# EAGLE design Populated_PLG_sensor_Flash (EAGLE 7.7.0)
CNAME: SOOFA; CREVISION: 1.0; DESIGNER: COLIN M.
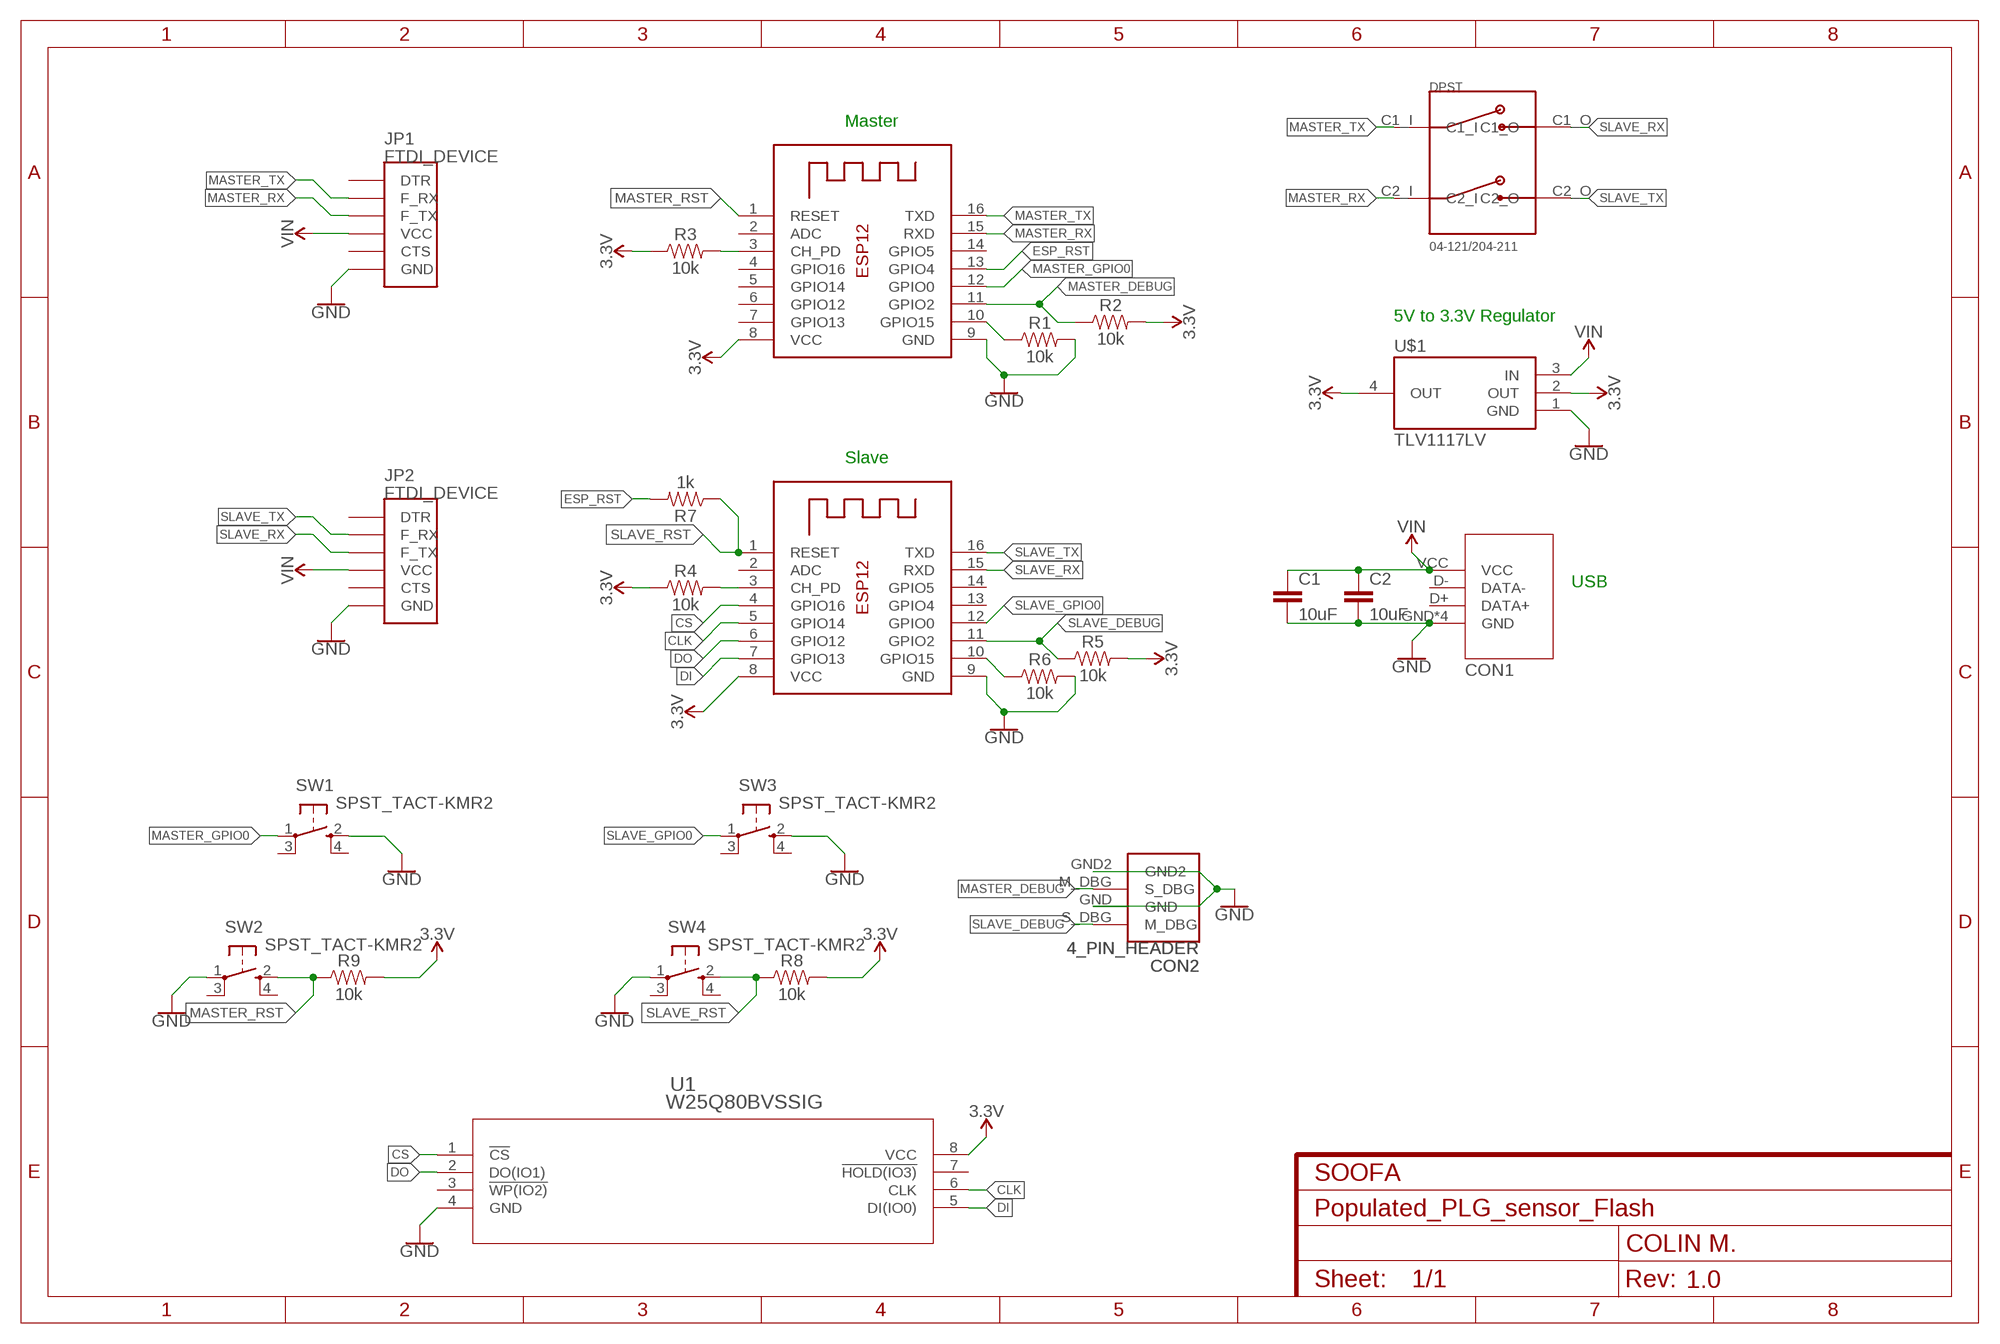
[diagram p0: schematic, sheet 1]

## Parts
C1  10uF  10UF-0603-6.3V-20%  [0603]
C2  10uF  10UF-0603-6.3V-20%  [0603]
CON1  USB_MOLEX_0480372200  [USB_MOLEX_0480372200]
CON2  4_PIN_HEADER  [22-23-2041]
DPST1  DPST_1POS  [DPST_1POS]
JP1  FTDI_DEVICE  [FTDI_DEVICE_SIDE]
JP2  FTDI_DEVICE  [FTDI_DEVICE_SIDE]
R1  10k  10KOHM-0603-1/10W-1%  [0603]
R2  10k  10KOHM-0603-1/10W-1%  [0603]
R3  10k  10KOHM-0603-1/10W-1%  [0603]
R4  10k  10KOHM-0603-1/10W-1%  [0603]
R5  10k  10KOHM-0603-1/10W-1%  [0603]
R6  10k  10KOHM-0603-1/10W-1%  [0603]
R7  1k  1KOHM-0603-1/10W-1%  [0603]
R8  10k  10KOHM-0603-1/10W-1%  [0603]
R9  10k  10KOHM-0603-1/10W-1%  [0603]
SW1  SPST_TACT-KMR2  [KMR2]
SW2  SPST_TACT-KMR2  [KMR2]
SW3  SPST_TACT-KMR2  [KMR2]
SW4  SPST_TACT-KMR2  [KMR2]
U1  W25Q80BVSSIG  [WIN_SS-8]
U$1  TLV1117LV  [SOT223]
X1  ESP-12  [ESP-12]
X2  ESP-12  [ESP-12]

## Nets
3.3V: R2.2 R3.1 R4.1 R5.2 R8.2 R9.2 U1.8(VCC) U$1.2(OUT) U$1.4(OUT) X1.8(VCC) X2.8(VCC)
CLK: U1.6(CLK) X2.5(GPIO14)
CS: U1.1(!CS) X2.4(GPIO16)
DI: U1.5(DI(IO0)) X2.7(GPIO13)
DO: U1.2(DO(IO1)) X2.6(GPIO12)
ESP_RST: R7.2 X1.13(GPIO4)
GND: C1.2 C2.2 CON1.GND CON1.GND2(GND) CON1.GND3(GND) CON1.GND4(GND) CON2.GND CON2.GND2 JP1.P$6(GND) JP2.P$6(GND) R1.2 R6.2 SW1.2(S) SW2.1(P) SW3.2(S) SW4.1(P) U1.4(GND) U$1.1(GND) X1.9(GND) X2.9(GND)
MASTER_DEBUG: CON2.M_DBG(S_DBG) R2.1 X1.11(GPIO2)
MASTER_GPIO0: SW1.1(P) X1.12(GPIO0)
MASTER_RST: R9.1 SW2.2(S) X1.1(RESET)
MASTER_RX: DPST1.C2_I JP1.P$3(F_TX) X1.15(RXD)
MASTER_TX: DPST1.C1_I JP1.P$2(F_RX) X1.16(TXD)
N$1: R3.2 X1.3(CH_PD)
N$2: R1.1 X1.10(GPIO15)
N$4: R4.2 X2.3(CH_PD)
N$8: R6.1 X2.10(GPIO15)
SLAVE_DEBUG: CON2.S_DBG(M_DBG) R5.1 X2.11(GPIO2)
SLAVE_GPIO0: SW3.1(P) X2.12(GPIO0)
SLAVE_RST: R7.1 R8.1 SW4.2(S) X2.1(RESET)
SLAVE_RX: DPST1.C1_O JP2.P$3(F_TX) X2.15(RXD)
SLAVE_TX: DPST1.C2_O JP2.P$2(F_RX) X2.16(TXD)
VIN: C1.1 C2.1 CON1.VCC JP1.P$4(VCC) JP2.P$4(VCC) U$1.3(IN)
Unconnected: CON1.D+(DATA+) CON1.D-(DATA-) JP1.P$1(DTR) JP1.P$5(CTS) JP2.P$1(DTR) JP2.P$5(CTS) SW1.3(P1) SW1.4(S1) SW2.3(P1) SW2.4(S1) SW3.3(P1) SW3.4(S1) SW4.3(P1) SW4.4(S1) U1.3(!WP(IO2)) U1.7(!HOLD(IO3)) X1.2(ADC) X1.4(GPIO16) X1.5(GPIO14) X1.6(GPIO12) X1.7(GPIO13) X1.14(GPIO5) X2.2(ADC) X2.13(GPIO4) X2.14(GPIO5)

## Notes on the sheet
- Master
- 5V to 3.3V Regulator
- Slave
- USB

## Library data of the parts
C1 C2 = SparkFun-Capacitors:10UF: 10.0µF ceramic capacitors A capacitor is a passive two-terminal electrical component used to store electrical energy temporarily in an electric field.; PROD_ID: CAP-11015
CON1 = Other:USB_MOLEX_0480372200
CON2 = Other:4_PIN_HEADER
DPST1 = Other:DPST_1POS
JP1 JP2 = 0_soofa_library:FTDI_DEVICE: Connector which mates to FTDI basic or FTDI cable.
R1-R6 R8 R9 = SparkFun-Resistors:10KOHM: 10kΩ resistor A resistor is a passive two-terminal electrical component that implements electrical resistance as a circuit element. Resistors act to reduce current flow, and, at the same time, act to lower voltage levels within circuits. - Wikipedia; PROD_ID: RES-00824
R7 = SparkFun-Resistors:1KOHM: 1kΩ resistor A resistor is a passive two-terminal electrical component that implements electrical resistance as a circuit element. Resistors act to reduce current flow, and, at the same time, act to lower voltage levels within circuits. - Wikipedia; PROD_ID: RES-07856
SW1-SW4 = adafruit:SPST_TACT: SMT 6mm switch, EVQQ2 series http://www.ladyada.net/library/eagle
U1 = SPI_Flash:W25Q80BVSSIG; MANUFACTURER_PART_NUMBER: W25Q80BVSSIG; VENDOR: WINBOND
U$1 = soofa_library:TLV1117LV
X1 X2 = adafruit:ESP-12

## Board
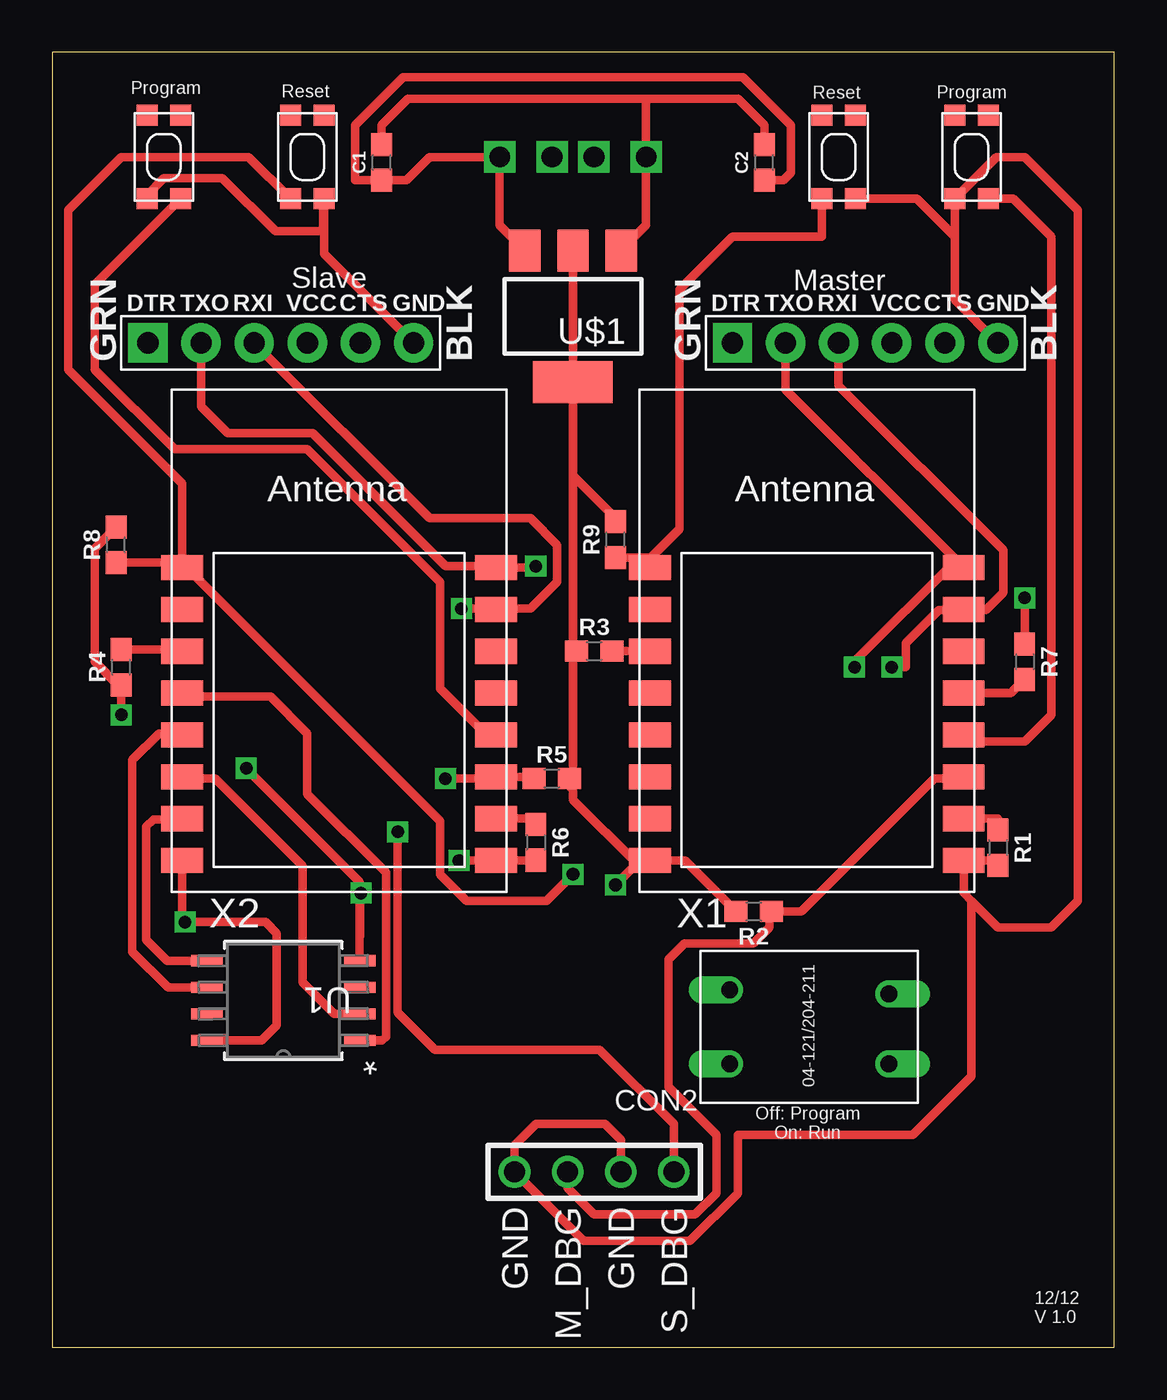
[diagram p1: board, top side]
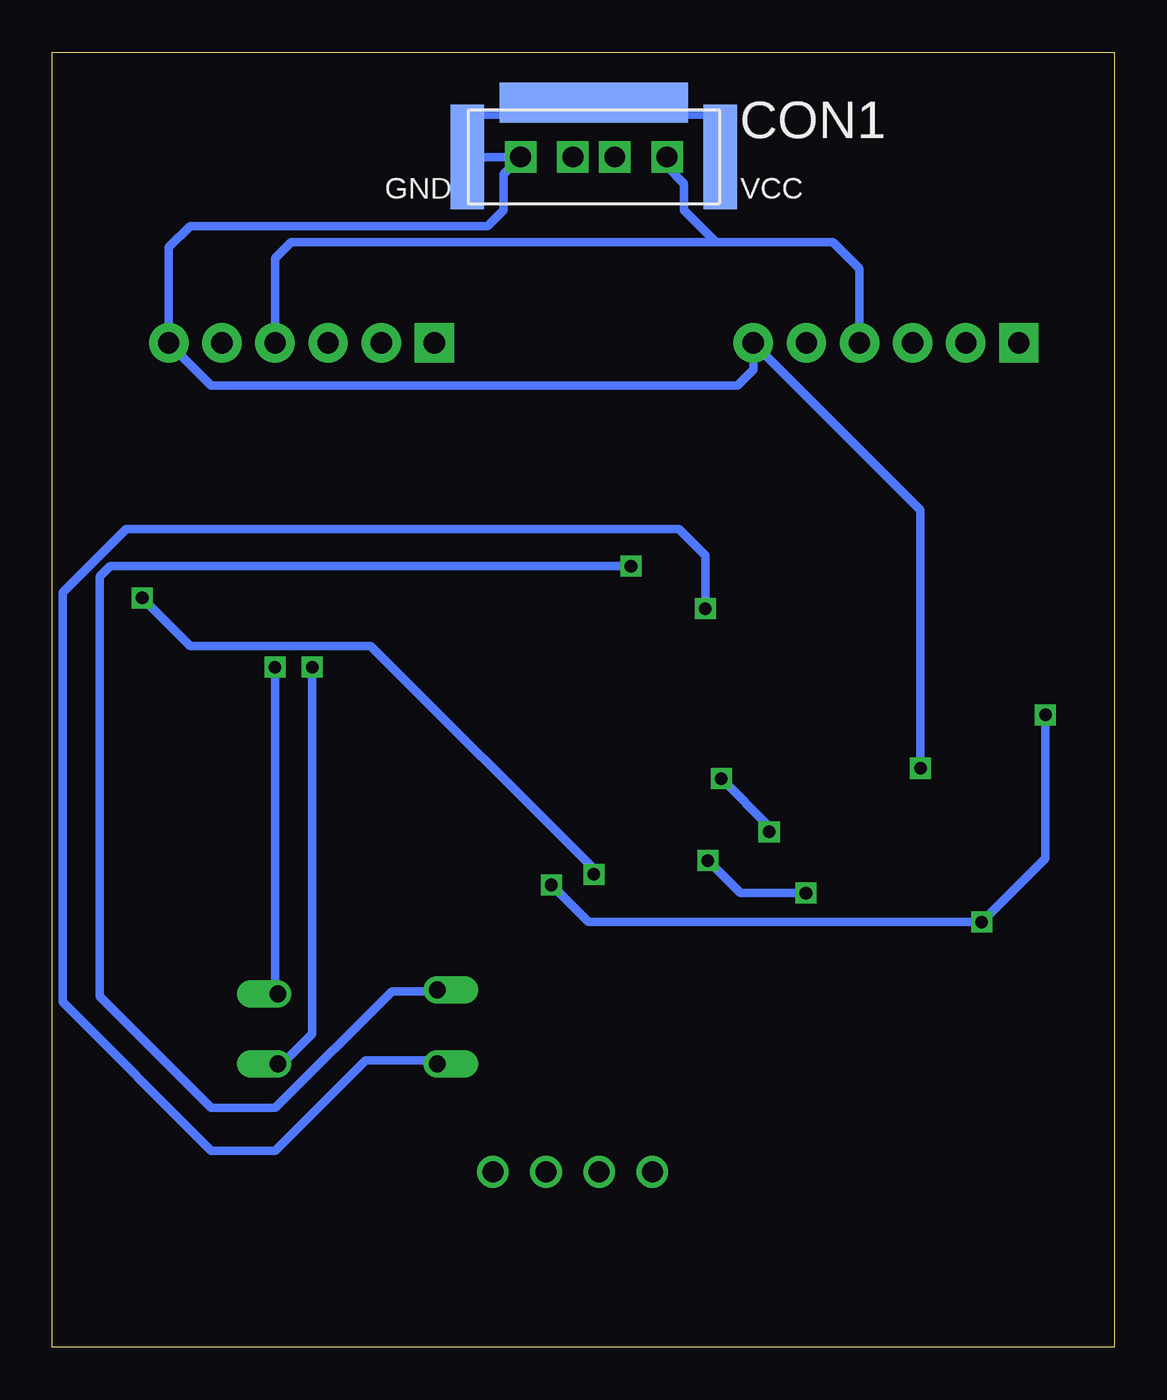
[diagram p2: board, bottom side, seen from below]

Size 50.78 x 61.9 mm. Coordinates in mm from the lower left corner, seen from the top.
Outline: 0,0 50.78,0 50.78,61.9 0,61.9 0,0
Copper layers (1*16): Top 0.035mm / dielectric 1.5mm / Bottom 0.035mm
Design rules "default": minimum track width 10mil, minimum drill 24mil, track to track 8mil, track to pad 8mil, pad to pad 8mil, via to via 8mil, smd to smd 8mil, copper to edge 40mil, drill to drill 8mil, minimum pad ring 10mil, minimum via ring 8mil, stop-mask expansion 4mil, vias tented up to drill 0mil, thermal gap 10mil

### Footprints (pad centres in the part's own frame; a part is rotated, then mirrored left to right if it is on the bottom)
0603 = smd 1.1 x 1: 1 -0.85,0; 2 0.85,0
USB_MOLEX_0480372200 = drill 1 square: D+ -1,0; D- 1,0; GND -3.5,0; VCC 3.5,0 | smd 1.6 x 5: GND2 -6.05,0; GND4 6.05,0 | smd 9 x 1.9: GND3 0,2.6
22-23-2041 = drill 1: GND -1.27,0; GND2 3.81,0; M_DBG 1.27,0; S_DBG -3.81,0
DPST_1POS = drill 0.8 offset: C1_I 1.86,-9.01; C1_O 1.86,-1.39; C2_I 5.2,-9.01; C2_O 5.4,-1.39
FTDI_DEVICE_SIDE = drill 1.016 pad 1.88 square: P$1 -6.35,0 | drill 1.016 pad 1.88: P$2 -3.81,0; P$3 -1.27,0; P$4 1.27,0; P$5 3.81,0; P$6 6.35,0
KMR2 = smd 1 x 1: 1 2,0.8; 2 2,-0.8; 3 -2,0.8; 4 -2,-0.8
WIN_SS-8 = smd 1.499 x 0.533: 1 -3.658,1.905; 2 -3.658,0.635; 3 -3.658,-0.635; 4 -3.658,-1.905; 5 3.658,-1.905; 6 3.658,-0.635; 7 3.658,0.635; 8 3.658,1.905
SOT223 = smd 1.5 x 2: 1 -2.3,-3.15; 2 0,-3.15; 3 2.3,-3.15 | smd 3.8 x 2: 4 0,3.15
ESP-12 = smd 2 x 1.2: 1 -7.5,4.5; 2 -7.5,2.5; 3 -7.5,0.5; 4 -7.5,-1.5; 5 -7.5,-3.5; 6 -7.5,-5.5; 7 -7.5,-7.5; 8 -7.5,-9.5; 9 7.5,-9.5; 10 7.5,-7.5; 11 7.5,-5.5; 12 7.5,-3.5; 13 7.5,-1.5; 14 7.5,0.5; 15 7.5,2.5; 16 7.5,4.5

### Placement (x,y rotation side)
C1  15.75,56.64 90 top
C2  34.04,56.64 90 top
CON1  24.89,56.9 0 bottom
CON2  25.91,8.38 180 top
DPST1  30.99,11.68 90 top
JP1  38.86,48.01 0 top
JP2  10.92,48.01 0 top
R1  45.21,23.88 270 top
R2  33.53,20.83 180 top
R3  25.91,33.27 0 top
R4  3.3,32.51 90 top
R5  23.88,27.18 0 top
R6  23.11,24.13 270 top
R7  46.48,32.77 270 top
R8  3.05,38.35 90 top
R9  26.92,38.61 90 top
SW1  43.94,56.9 270 top
SW2  37.59,56.9 270 top
SW3  5.33,56.9 270 top
SW4  12.19,56.9 270 top
U1  11.04,16.57 180 top
U$1  24.89,49.28 180 top
X1  36.07,32.77 0 top
X2  13.72,32.77 0 top

### Tracks (layer width: path | path; a pad name or v marks a point on that pad's centre or on a via)
3.3V  (via drill 0.6)
  Top 0.406: U$1.2 U$1.4 24.89,41.66 | 24.89,41.66 24.89,33.27 | 24.89,33.27 24.89,27.18 | 24.89,27.18 24.89,26.67 | 24.89,26.67 24.89,26.16 27.94,23.11 | 27.94,23.11 28.42,23.11 X1.8 30.24,23.27 R2.2 | X2.8 6.22,20.45 v6.35,20.32 10.2,20.32 10.73,19.79 10.73,15.38 10.01,14.67 U1.8 | v26.92,22.1 27.94,23.11 | 24.73,26.84 24.89,26.67 | R3.1 24.89,33.27 | v3.3,30.23 R4.1 3.14,31.66 2.03,32.77 2.03,38.19 R8.2 | R9.2 26.92,39.62 24.89,41.66 | R5.2 24.89,27.18
  Bottom 0.406: v26.92,22.1 25.15,20.32 v6.35,20.32 3.3,23.37 v3.3,30.23
CLK
  Top 0.406: U1.6 5.53,17.21 3.83,18.91 3.83,28.06 5.1,29.33 6.15,29.33 X2.5
CS
  Top 0.406: U1.1 15.77,14.67 15.95,14.84 15.95,22.7 12.19,26.46 12.19,29.34 10.43,31.1 6.38,31.1 X2.4
DI
  Top 0.406: U1.5 5.49,18.48 4.49,19.48 4.49,24.89 4.84,25.24 6.19,25.24 X2.7
DO
  Top 0.406: U1.2 13.47,15.94 11.96,17.45 11.96,23.01 7.78,27.19 6.29,27.19 X2.6
ESP_RST
  Top 0.406: X1.13 45.83,31.27 R7.2
GND  (via drill 0.6)
  Top 0.406: U$1.1 28.39,53.63 CON1.GND 28.39,59.69 | 43.14,53.09 SW1.2 45.14,56.9 46.48,56.9 49.02,54.36 49.02,21.34 47.75,20.07 45.21,20.07 43.94,21.34 | 43.14,53.09 43.14,50.08 JP1.P$6 | SW2.1 41.33,54.9 43.14,53.09 | X2.9 23.1,23.27 R6.2 | SW3.2 4.53,55.08 5.33,55.88 8.13,55.88 10.67,53.34 12.95,53.34 12.95,54.9 SW4.1 12.99,52.29 JP2.P$6 | CON2.GND 27.18,9.91 26.42,10.67 23.11,10.67 22.1,9.65 CON2.GND2 25.4,5.08 30.48,5.08 32.77,7.37 32.77,10.16 41.15,10.16 43.94,12.95 43.94,21.34 | 43.94,21.34 43.57,21.71 X1.9 45.21,23.27 R1.2 | C1.2 15.75,58.42 17.02,59.69 28.39,59.69 | C2.2 34.04,58.42 32.77,59.69 28.39,59.69 | v14.75,21.71 14.71,21.67 14.71,19.64 14.7,19.63 U1.4 14.7,22.25 v9.28,27.68 | v19.45,23.27 X2.9 | X2.9
  Bottom 0.406: CON1.GND 29.21,56.08 29.21,54.36 29.97,53.59 44.2,53.59 45.21,52.58 JP1.P$6 43.18,45.97 18.03,45.97 17.27,46.74 JP2.P$6 9.28,40.01 v9.28,27.68 | CON1.GND CON1.GND2 | 28.39,59.24 28.19,59.44 24.95,59.44 | 24.95,59.44 CON1.GND3 24.89,58.93 30.99,58.93 | CON1.GND4 18.84,58.93 21.59,58.93 21.59,59.44 24.95,59.44 | CON1.GND 30.99,56.9 30.99,58.93 | 30.99,59.18 30.99,58.93 | v14.75,21.71 17.89,21.71 v19.45,23.27
MASTER_DEBUG
  Top 0.406: X1.11 43.48,27.18 42.16,27.18 35.81,20.83 R2.1 34.29,20.74 34.29,20.07 33.53,19.3 30.23,19.3 29.46,18.54 29.46,12.45 31.75,10.16 31.75,7.37 30.73,6.35 25.91,6.35 24.64,7.62 CON2.M_DBG
MASTER_GPIO0
  Top 0.406: SW1.1 45.94,54.9 47.75,53.09 47.75,30.23 46.48,28.96 43.88,28.96 X1.12
MASTER_RST
  Top 0.406: X1.1 28.08,37.76 R9.1 28.61,37.76 29.97,39.12 29.97,50.55 32.51,53.09 36.79,53.09 SW2.2
MASTER_RX  (via drill 0.6)
  Top 0.406: JP1.P$3 37.59,45.97 45.47,38.1 45.47,36.08 44.63,35.24 43.59,35.24 X1.15 43.54,35.23 42.38,35.23 40.81,33.67 40.81,32.51 v40.13,32.51
  Bottom 0.406: DPST1.C2_I 40.13,16.88 v40.13,32.51
MASTER_TX  (via drill 0.6)
  Top 0.406: JP1.P$2 35.05,45.78 43.21,37.62 | 43.21,37.62 X1.16 | v38.35,32.51 38.35,32.77 43.21,37.62
  Bottom 0.406: DPST1.C1_I 39.8,13.54 38.35,14.99 v38.35,32.51
N$1
  Top 0.406: R3.2 X1.3
N$2
  Top 0.406: X1.10 45.21,25.27 R1.1
N$4
  Top 0.406: R4.2 6.12,33.36 X2.3
N$8
  Top 0.406: X2.10 22.83,25.27 R6.1
SLAVE_DEBUG  (via drill 0.6)
  Top 0.406: CON2.S_DBG 29.72,10.67 26.16,14.22 18.29,14.22 16.51,16 v16.51,24.64 | v18.8,27.18 21.13,27.18 X2.11 22.94,27.27 R5.1
  Bottom 0.406: v16.51,24.64 16.51,24.89 v18.8,27.18
SLAVE_GPIO0
  Top 0.406: X2.12 21.08,29.13 21.08,28.96 18.54,31.5 18.54,36.58 12.19,42.93 5.84,42.93 2.03,46.74 2.03,50.79 SW3.1
SLAVE_RST  (via drill 0.6)
  Top 0.406: R8.1 5.98,37.5 X2.1 | X2.1 6.22,41.28 0.76,46.74 0.76,54.36 3.3,56.9 9.39,56.9 SW4.2 | X2.1 6.42,37.27 18.54,25.15 18.54,22.61 19.81,21.34 23.62,21.34 v24.89,22.61 | v46.48,35.81 R7.1
  Bottom 0.406: v24.89,22.61 24.89,22.86 35.56,33.53 44.2,33.53 v46.48,35.81
SLAVE_RX  (via drill 0.6)
  Top 0.406: 21.26,35.31 X2.15 | 21.26,35.31 22.86,35.31 24.13,36.58 24.13,38.35 22.86,39.62 18.03,39.62 JP2.P$3 | 21.26,35.31 v19.56,35.31
  Bottom 0.406: v19.56,35.31 19.56,37.85 20.83,39.12 47.24,39.12 50.29,36.07 50.29,16.51 43.18,9.4 40.13,9.4 35.81,13.72 32.55,13.72 DPST1.C1_O
SLAVE_TX  (via drill 0.6)
  Top 0.406: JP2.P$2 7.11,44.96 8.38,43.69 12.45,43.69 18.8,37.34 21.14,37.34 X2.16 23.04,37.27 v23.11,37.34
  Bottom 0.406: v23.11,37.34 48.01,37.34 48.51,36.83 48.51,16.76 43.18,11.43 40.13,11.43 34.54,17.02 32.44,17.02 DPST1.C2_O
VIN
  Top 0.406: U$1.3 21.39,53.63 CON1.VCC 18.03,56.9 16.93,55.79 C1.1 14.48,55.79 14.48,58.42 16.76,60.71 33.02,60.71 35.31,58.42 35.31,56.13 34.96,55.79 C2.1
  Bottom 0.406: CON1.VCC 21.39,56.44 20.57,55.63 20.57,54.36 19.05,52.83 | 19.05,52.83 13.46,52.83 12.19,51.56 JP2.P$4 | JP1.P$4 40.13,52.07 39.37,52.83 19.05,52.83

### Text on the board
tNames: Program | Reset | Reset | Program | Master | Slave | Off: Program / On: Run | 12/12 / V 1.0
201bmp: C:/Users/mckenneyc/Desktop/soofa logo.bmp